# EAGLE design AEMSUCA-R3 (EAGLE 9.6.2)
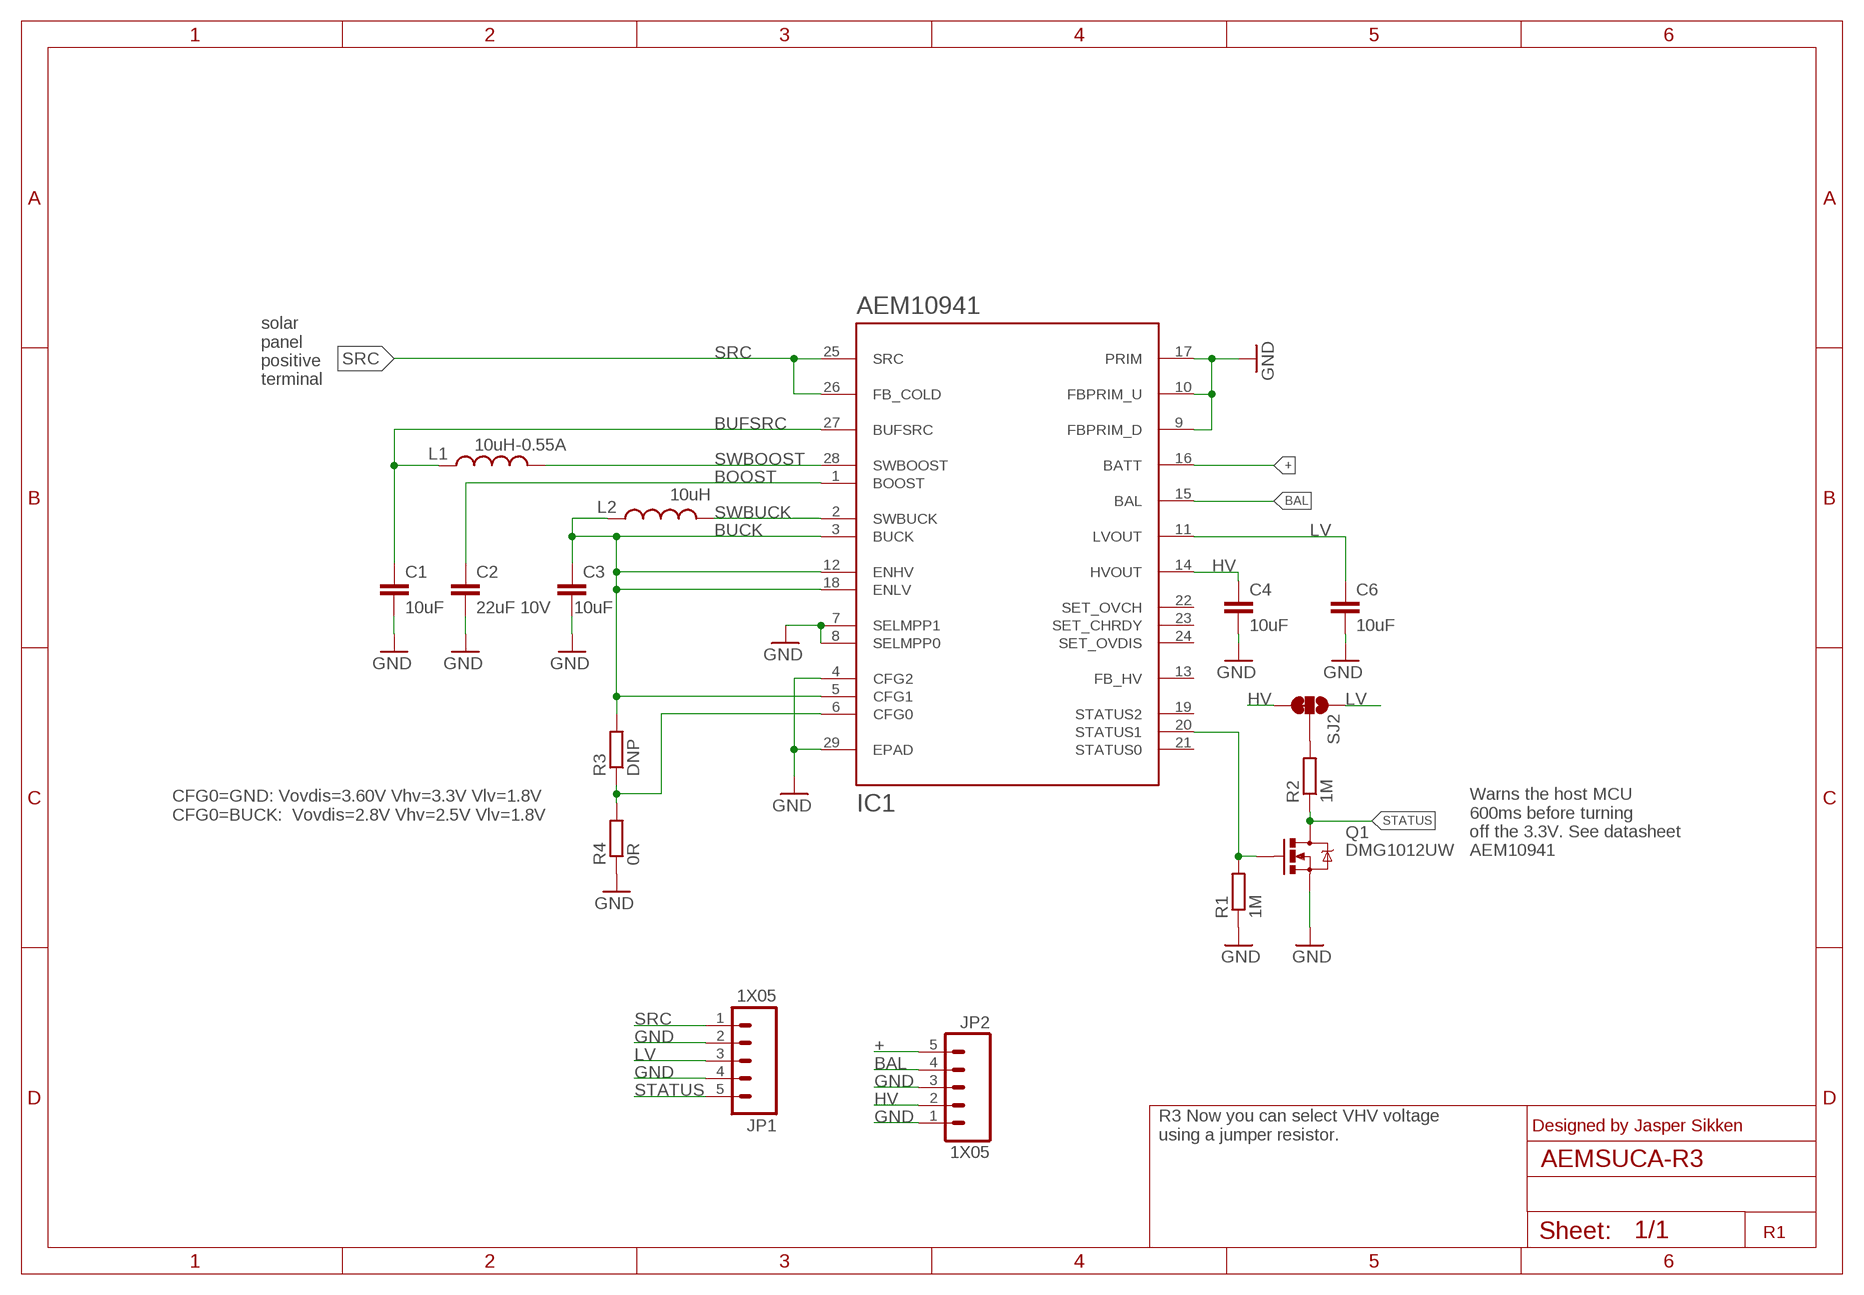
[diagram p0: schematic, sheet 1]

## Parts
C1  10uF  C0603_10UF  [C0603]
C2  22uF 10V  C0603_22UF  [C0603]
C3  10uF  C0603_10UF  [C0603]
C4  10uF  C0603_10UF  [C0603]
C6  10uF  C0603_10UF  [C0603]
IC1  AEM10941  [QFN50P505X505X90-28]
JP1  1X05  [1X05_2.54MM_ROUND_NOSILK]
JP2  1X05  [1X05_2.54MM_ROUND_NOSILK]
L1  10uH-0.55A  L3.9X3.9_10UH_0.55A  [LPS4012]
L2  10uH  L0603_10UH  [L0603]
Q1  DMG1012UW  MOSFET-N-CHANNEL_DMG1012UW  [SOT323]
R1  1M  R0402_1M  [R0402]
R2  1M  R0402_1M  [R0402]
R3  DNP  R0402_1M  [R0402]
R4  0R  R0402_1M  [R0402]
SJ2  SOLDERJUMPER_3WAY_12SHORT3WAY  [SJ_3S_NC_0402]

## Nets
+: IC1.16(BATT) JP2.5
BAL: IC1.15(BAL) JP2.4
BOOST: C2.1 IC1.1(BOOST)
BUCK: C3.1 IC1.3(BUCK) IC1.5(CFG1) IC1.12(ENHV) IC1.18(ENLV) L2.1 R3.2
BUFSRC: C1.1 IC1.27(BUFSRC) L1.1
GND: C1.2 C2.2 C3.2 C4.2 C6.2 IC1.4(CFG2) IC1.7(SELMPP1) IC1.8(SELMPP0) IC1.9(FBPRIM_D) IC1.10(FBPRIM_U) IC1.17(PRIM) IC1.29(EPAD) JP1.2 JP1.4 JP2.1 JP2.3 Q1.2(S) R1.1 R4.1
HV: C4.1 IC1.14(HVOUT) JP2.2 SJ2.1
LV: C6.1 IC1.11(LVOUT) JP1.3 SJ2.3
N$1: R2.2 SJ2.2
N$3: IC1.6(CFG0) R3.1 R4.2
SRC: IC1.25(SRC) IC1.26(FB_COLD) JP1.1
STATUS: JP1.5 Q1.3(D) R2.1
STATUS1: IC1.20(STATUS1) Q1.1(G) R1.2
SWBOOST: IC1.28(SWBOOST) L1.2
SWBUCK: IC1.2(SWBUCK) L2.2
Unconnected: IC1.13(FB_HV) IC1.19(STATUS2) IC1.21(STATUS0) IC1.22(SET_OVCH) IC1.23(SET_CHRDY) IC1.24(SET_OVDIS)

## Notes on the sheet
- solar
  panel
  positive
  terminal
- CFG0=GND: Vovdis=3.60V Vhv=3.3V Vlv=1.8V
  CFG0=BUCK:  Vovdis=2.8V Vhv=2.5V Vlv=1.8V
- Warns the host MCU
  600ms before turning
  off the 3.3V. See datasheet
  AEM10941
- Designed by Jasper Sikken
- R3 Now you can select VHV voltage 
  using a jumper resistor.
- R1

## Library data of the parts
C1 C3 C4 C6 = TSEM:C: Non-polarized capacitor; FARNELL_OC: 2113070; MF: Taiyo Yuden; MPN: LMK107BBJ106MALT
C2 = TSEM:C: Non-polarized capacitor; FARNELL_OC: 2426957; MF: Murata; MPN: GRM188R61A226ME15D
IC1 = TSEM:AEM10941: Ambient Energy Manager from e-peas; MF: e-peas; MPN: AEM10941
JP1 JP2 = TSEM:1X05
L1 = TSEM:L: Inductor; FARNELL_OC: 2408076; MF: Coilcraft; MPN: LPS4012-103MRB
L2 = TSEM:L: Inductor; FARNELL_OC: 2215635; MF: TDK; MPN: MLZ1608M100WT
Q1 = TSEM:MOSFET-N-CHANNEL: Mosfet N channel; FARNELL_OC: 2061403; MF: Diodes; MPN: DMG1012UW-7
R1 R2 = TSEM:R: Resistor; FARNELL_OC: 2502499; MF: Walsin; MPN: WR04X1004FTL
R3 R4 = TSEM:R: Resistor; FARNELL_OC: 2502499; OC_NEWARK: unknown; VALUE: 1M
SJ2 = sodaq:SOLDERJUMPER_3WAY_12SHORT

## Board
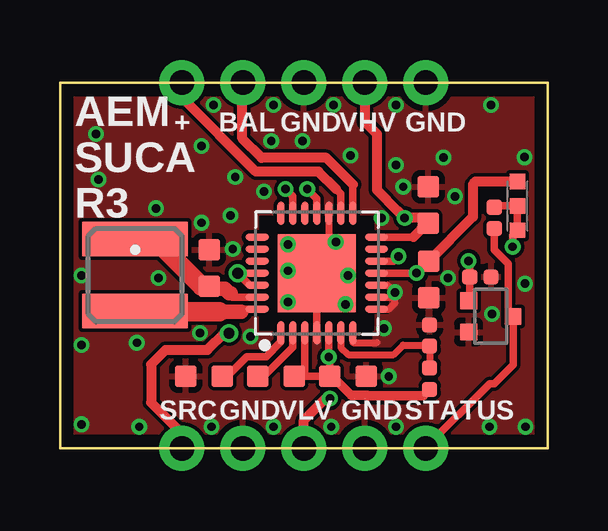
[diagram p1: board, top side]
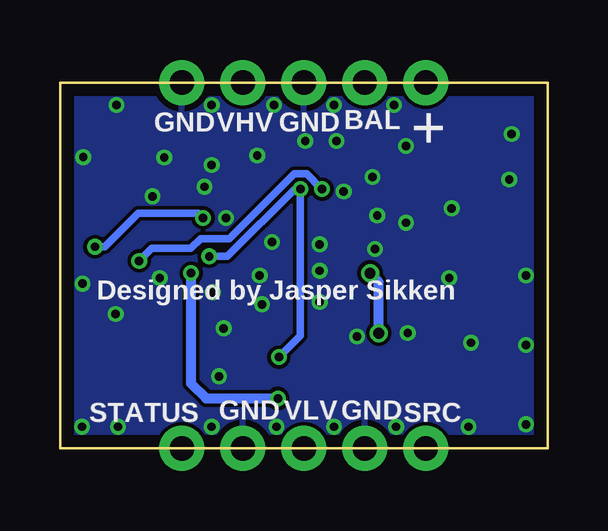
[diagram p2: board, bottom side, seen from below]

Size 20.32 x 15.24 mm. Coordinates in mm from the lower left corner, seen from the top.
Outline: 0,0 0,15.24 20.32,15.24 20.32,0 0,0
Copper layers (1*16): Top 0.035mm / dielectric 1.6mm / Bottom 0.035mm
Design rules "Elecrow_2-layer_PCB_eagle_rule": minimum track width 6mil, minimum drill 12mil, track to track 6mil, track to pad 6mil, pad to pad 6mil, via to via 8mil, smd to smd 0mil, copper to edge 20mil, drill to drill 10mil, minimum pad ring 6mil, minimum via ring 6mil, stop-mask expansion 0mil, vias tented up to drill 100mil, thermal gap 10mil
tRestrict: area 12,4.2 to 13,5.3; area 12.7,5.6 to 13.7,7

### Footprints (pad centres in the part's own frame; a part is rotated, then mirrored left to right if it is on the bottom)
C0603 = smd 0.889 x 0.889: 1 -0.762,0; 2 0.762,0
QFN50P505X505X90-28 = smd 0.977 x 0.292: 1 -2.486,1.5; 2 -2.486,1; 3 -2.486,0.5; 4 -2.486,0; 5 -2.486,-0.5; 6 -2.486,-1; 7 -2.486,-1.5; 15 2.486,-1.5; 16 2.486,-1; 17 2.486,-0.5; 18 2.486,0; 19 2.486,0.5; 20 2.486,1; 21 2.486,1.5 | smd 0.292 x 0.977: 8 -1.5,-2.486; 9 -1,-2.486; 10 -0.5,-2.486; 11 0,-2.486; 12 0.5,-2.486; 13 1,-2.486; 14 1.5,-2.486; 22 1.5,2.486; 23 1,2.486; 24 0.5,2.486; 25 0,2.486; 26 -0.5,2.486; 27 -1,2.486; 28 -1.5,2.486 | smd 3.25 x 3.25: 29 0,0
1X05_2.54MM_ROUND_NOSILK = drill 1.016 pad 1.88: 1 0,0; 2 2.54,0; 3 5.08,0; 4 7.62,0; 5 10.16,0
LPS4012 = smd 1.45 x 4.4: 1 -1.5,0; 2 1.5,0
L0603 = smd 0.889 x 0.889: 1 -0.762,0; 2 0.762,0
SOT323 = smd 0.7 x 0.7: 1 -0.65,-0.925; 2 0.65,-0.925; 3 0,0.925
R0402 = smd 0.635 x 0.635: 1 -0.445,0; 2 0.445,0
SJ_3S_NC_0402 = smd 0.635 x 0.65: 1 -1.016,0; 2 0,0; 3 1.016,0

### Placement (x,y rotation side)
C1  6.22,7.52 90 top
C2  6,3 180 top
C3  12,3 0 top
C4  15.34,10.13 90 top
C6  15.36,7.04 270 top
IC1  10.7,7.3 90 top
JP1  5.08,0 0 top
JP2  15.24,15.24 180 top
L1  3.13,7.22 270 top
L2  9,3 180 top
Q1  17.95,5.5 270 top
R1  17.52,7.14 180 top
R2  18.09,9.6 90 top
R3  15.4,2.9 270 top
R4  15.4,4.7 270 top
SJ2  19.06,10.1 90 top

### Tracks (layer width: path | path; a pad name or v marks a point on that pad's centre or on a via)
+
  Top 0.305: 11.5,10.8 11.7,10.6 IC1.16
  Top 0.406: JP2.5 5.05,15.21 5.05,14.64 8.16,11.53 10.77,11.53 11.5,10.8
BAL
  Top 0.305: IC1.15 12.2,11
  Top 0.406: 12.2,11 11.1,12.1 8.4,12.1 7.6,12.9 7.6,14.48 7.62,14.5 JP2.4
BOOST
  Top 0.305: IC1.1 9.2,4.43 8.59,3.82 7.79,3.82 6.97,3 C2.1
BUCK  (via drill 0.35)
  Top 0.305: IC1.3 10.2,3.19 10.01,3 L2.1 C3.1 11.24,3.76 | IC1.12 13.9,7.8 v14.1,8 | IC1.5 v11.2,3.8 | IC1.18 10.7,10.4 v10.3,10.8
  Top 0.4: C3.1 11.34,3 12.14,2.2 12.8,2.2 15.14,2.2 R3.2
  Top 0.406: v11.2,3.8 11.24,3.76
  Bottom 0.305: v11.2,3.8 10.3,4.7 v10.3,10.8 10.55,10.8 13.35,8 v14.1,8
BUFSRC
  Top 0.305: IC1.27 7.17,6.3 7.11,6.36 7.11,6.46
  Top 0.61: 7.11,6.46 7.05,6.46 6.87,6.65 6.33,6.65 C1.1
  Top 0.813: L1.1 3.94,8.72 5.9,6.76 C1.1
GND  (via drill 0.35)
  Top 0.152: 10.32,7.87 9.85,7.4 v9.5,7.4 | 10.32,7.87 10.32,7.68 IC1.29 10.7,7.5 10.32,7.87
  Top 0.3: IC1.7 12.2,4.41 12.21,4.4 13.2,4.4 | IC1.17 11.2,8.83 11.36,8.67 | IC1.10 13.65,6.8 v13.95,6.5 | IC1.9 13.75,6.3 v13.95,6.5 | IC1.8 13.7,5.8 13.95,6.05 v13.95,6.5
  Top 0.305: 11.7,6.3 IC1.29 12.07,8.67 11.56,8.67 | 11.56,8.67 11.36,8.67 | 11.56,8.67 v11.49,8.6 | IC1.4 10.7,6.2 v9.5,7.4
  other vias: 3.2,4.4 13.7,3 9.5,8.5 9.5,6.1 11.9,6 12,7.2 7.1,9.7 4,10 3.3,0.9 0.9,1 8.9,0.9 11.3,0.9 17.9,0.9 5.83,4.8 0.9,7.2 0.9,4.3 8.5,10.7 13.4,9.6 15.98,12.12 16.46,10.5 17.96,14.3 16.16,7.1 6.31,0.9 7.94,4.66 19.35,12.13 7.2,8.3 5.9,9.4 4.1,7.1 14.3,10.9 14,14.3 11.4,14.3 8.9,14.3 6.4,14.3 19.38,6.86 1.5,13.1 1.6,11.2 13.5,5 8.8,12.8 10.1,12.8 5.9,12.6 7.3,11.3 12.1,12.2 14,11.8 14,0.9 19.4,0.9 18,5.6
  pour Top: 0,15.24 20.32,15.24 20.32,0 0,0
  pour Bottom: 0,15.24 20.32,15.24 20.32,0 0,0
HV  (via drill 0.35)
  Top 0.3: C4.1 15.11,9.6 | SJ2.1 18.86,8.88
  Top 0.305: IC1.14 14.72,8.8 | 18.86,8.88 v18.86,8.4
  Top 0.406: 14.72,8.8 15.29,9.37 C4.1 | 15.11,9.6 v14.36,9.6 14.08,9.88 13.2,10.77 13.2,13.1 12.7,13.6 JP2.2
  Bottom 0.305: v18.86,8.4 18.46,8.4 17.06,9.8 14.56,9.8 v14.36,9.6
LV  (via drill 0.35)
  Top 0.305: IC1.11 v14.86,7.3
  Top 0.406: v14.86,7.3 C6.1 17.2,9.64 17.2,11 17.32,11.12 SJ2.3 | JP1.3 10.16,1.16 11.08,2.08 v11.24,2.08
  Bottom 0.406: v14.86,7.3 14.86,2.7 14.23,2.08 v11.24,2.08
N$1
  Top 0.305: SJ2.2 18.15,10.1 R2.2
N$3
  Top 0.3: IC1.6 11.7,4.2 12,3.9 13.9,3.9 14.3,4.3 15.36,4.3 R4.2 R3.1
SRC  (via drill 0.45)
  Top 0.305: IC1.25 v7.4,7.3 7.9,6.8 IC1.26
  Top 0.406: v7.04,4.8 6.84,4.8 6.14,4.1 4.4,4.1 3.8,3.5 3.8,1.9 5.08,0.62 JP1.1
  Bottom 0.406: v7.04,4.8 7.04,6.94 v7.4,7.3
STATUS
  Top 0.305: R2.1 18.09,8.27 18.68,7.69 18.68,5.7 Q1.3 18.88,3.48 18.1,2.7 17.9,2.7 15.24,0.04 JP1.5
STATUS1  (via drill 0.35)
  Top 0.305: IC1.20 9.7,10.5 v9.4,10.8 | Q1.1 17.08,6.2 R1.2 17.08,7.76 v17.02,7.81
  Bottom 0.305: v9.4,10.8 v9.41,10.8 10.04,11.43 10.56,11.43 13.26,8.73 14.46,8.73 14.86,8.33 16.5,8.33 v17.02,7.81
SWBOOST
  Top 0.305: L1.2 3.1,5.69 | IC1.28 7.67,5.8 7.56,5.69
  Top 0.61: 7.56,5.69 6.64,5.69
  Top 0.813: 6.64,5.69 3.1,5.69
SWBUCK
  Top 0.305: IC1.2 9.7,4.22 8.48,3 L2.2

### Text on the board
tPlace: + | BAL | GND | VHV | GND | AEM / SUCA / R3 | SRC | GND | VLV | GND | STATUS
bNames: BAL | GND | VHV | GND | + | Designed by Jasper Sikken | SRC | GND | VLV | GND | STATUS